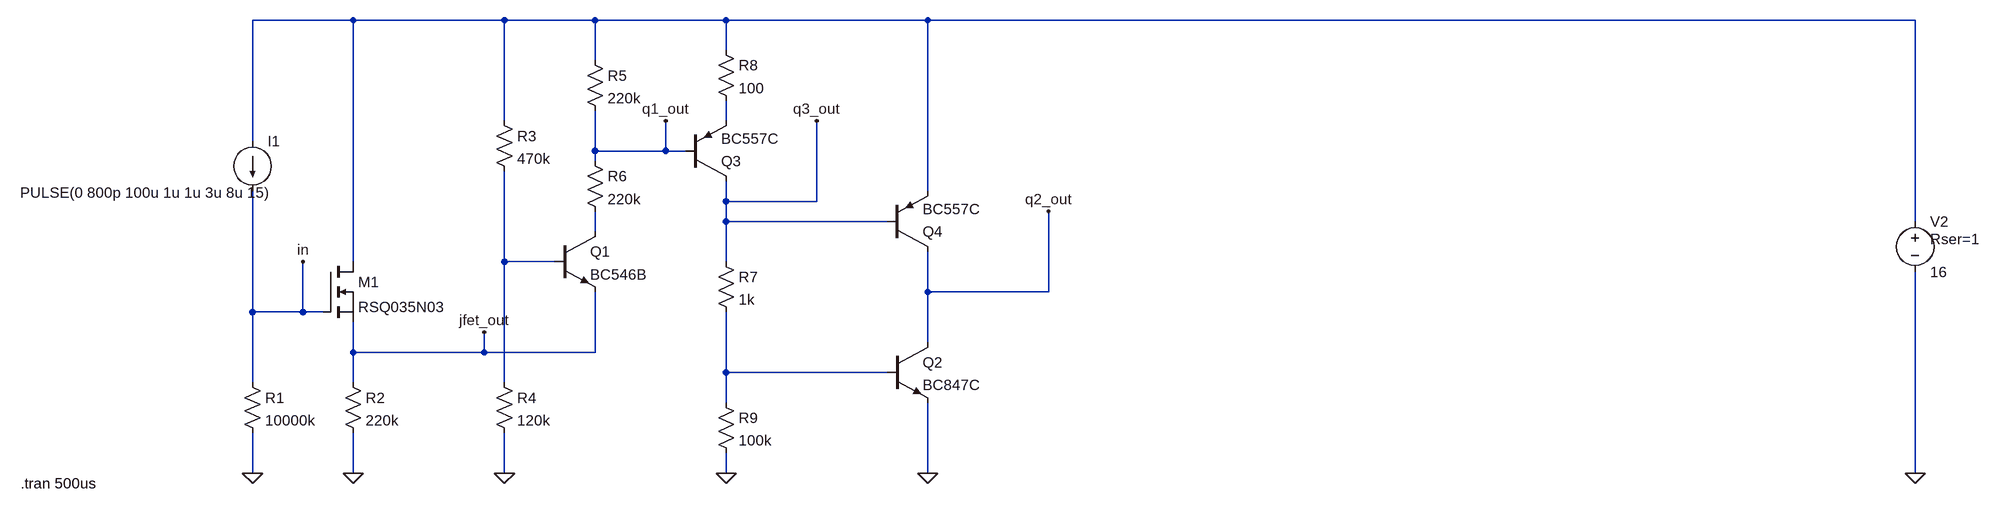
[diagram p0: schematic Simulation1.asc]
Simulation1.asc, the LTspice schematic file:
Version 4
SHEET 1 2732 680
WIRE 144 -656 -16 -656
WIRE 384 -656 144 -656
WIRE 528 -656 384 -656
WIRE 736 -656 528 -656
WIRE 1056 -656 736 -656
WIRE 2624 -656 1056 -656
WIRE 736 -608 736 -656
WIRE 528 -592 528 -656
WIRE 384 -496 384 -656
WIRE 736 -496 736 -528
WIRE -16 -464 -16 -656
WIRE 528 -448 528 -512
WIRE 640 -448 640 -496
WIRE 640 -448 528 -448
WIRE 672 -448 640 -448
WIRE 528 -432 528 -448
WIRE 1056 -384 1056 -656
WIRE 736 -368 736 -400
WIRE 880 -368 880 -496
WIRE 880 -368 736 -368
WIRE 736 -336 736 -368
WIRE 992 -336 736 -336
WIRE 2624 -336 2624 -656
WIRE 528 -320 528 -352
WIRE 144 -272 144 -656
WIRE 384 -272 384 -416
WIRE 464 -272 384 -272
WIRE 736 -272 736 -336
WIRE 1056 -224 1056 -288
WIRE 1248 -224 1248 -352
WIRE 1248 -224 1056 -224
WIRE -16 -192 -16 -384
WIRE 64 -192 64 -272
WIRE 64 -192 -16 -192
WIRE 96 -192 64 -192
WIRE 1056 -144 1056 -224
WIRE 144 -128 144 -176
WIRE 352 -128 352 -160
WIRE 352 -128 144 -128
WIRE 528 -128 528 -224
WIRE 528 -128 352 -128
WIRE 736 -96 736 -192
WIRE 992 -96 736 -96
WIRE -16 -80 -16 -192
WIRE 144 -80 144 -128
WIRE 384 -80 384 -272
WIRE 736 -48 736 -96
WIRE -16 64 -16 0
WIRE 144 64 144 0
WIRE 384 64 384 0
WIRE 736 64 736 32
WIRE 1056 64 1056 -48
WIRE 2624 64 2624 -256
FLAG -16 64 0
FLAG 144 64 0
FLAG 2624 64 0
FLAG 352 -160 jfet_out
FLAG 64 -272 in
FLAG 384 64 0
FLAG 640 -496 q1_out
FLAG 736 64 0
FLAG 880 -496 q3_out
FLAG 1056 64 0
FLAG 1248 -352 q2_out
SYMBOL res 128 -96 R0
SYMATTR InstName R2
SYMATTR Value 220k
SYMATTR SpiceLine tol=1 pwr=0.1
SYMBOL voltage 2624 -352 R0
WINDOW 123 0 0 Left 0
WINDOW 39 24 44 Left 2
SYMATTR SpiceLine Rser=1
SYMATTR InstName V2
SYMATTR Value 16
SYMBOL res -32 -96 R0
SYMATTR InstName R1
SYMATTR Value 10000k
SYMATTR SpiceLine tol=1 pwr=0.1
SYMBOL res 368 -512 R0
SYMATTR InstName R3
SYMATTR Value 470k
SYMBOL res 368 -96 R0
SYMATTR InstName R4
SYMATTR Value 120k
SYMBOL res 512 -608 R0
SYMATTR InstName R5
SYMATTR Value 220k
SYMBOL res 512 -448 R0
SYMATTR InstName R6
SYMATTR Value 220k
SYMBOL npn 464 -320 R0
SYMATTR InstName Q1
SYMATTR Value BC546B
SYMBOL res 720 -288 R0
SYMATTR InstName R7
SYMATTR Value 1k
SYMBOL pnp 672 -400 M180
SYMATTR InstName Q3
SYMATTR Value BC557C
SYMBOL current -16 -464 R0
WINDOW 3 -369 82 Left 2
WINDOW 123 0 0 Left 0
WINDOW 39 0 0 Left 0
SYMATTR Value PULSE(0 800p 100u 1u 1u 3u 8u 15)
SYMATTR InstName I1
SYMBOL nmos 96 -272 R0
SYMATTR InstName M1
SYMATTR Value RSQ035N03
SYMBOL npn 992 -144 R0
SYMATTR InstName Q2
SYMATTR Value BC847C
SYMBOL res 720 -64 R0
SYMATTR InstName R9
SYMATTR Value 100k
SYMBOL pnp 992 -288 M180
SYMATTR InstName Q4
SYMATTR Value BC557C
SYMBOL res 720 -624 R0
SYMATTR InstName R8
SYMATTR Value 100
TEXT -384 80 Left 2 !.tran 500us

The netlist it stands for:
* Simulation1.asc
R2 jfet_out 0 220k tol=1 pwr=0.1
V2 N001 0 16 Rser=1
R1 in 0 10000k tol=1 pwr=0.1
R3 N001 N004 470k
R4 N004 0 120k
R5 N001 q1_out 220k
R6 q1_out N003 220k
Q1 N003 N004 jfet_out 0 BC546B
R7 q3_out N005 1k
Q3 q3_out q1_out N002 0 BC557C
I1 N001 in PULSE(0 800p 100u 1u 1u 3u 8u 15)
M1 N001 in jfet_out jfet_out RSQ035N03
Q2 q2_out N005 0 0 BC847C
R9 N005 0 100k
Q4 q2_out q3_out N001 0 BC557C
R8 N001 N002 100
.model NPN NPN
.model PNP PNP
.lib standard.bjt
.model NMOS NMOS
.model PMOS PMOS
.lib standard.mos
.tran 500us
.backanno
.end